# EAGLE design RGB Panel v-1 (EAGLE 6.3)
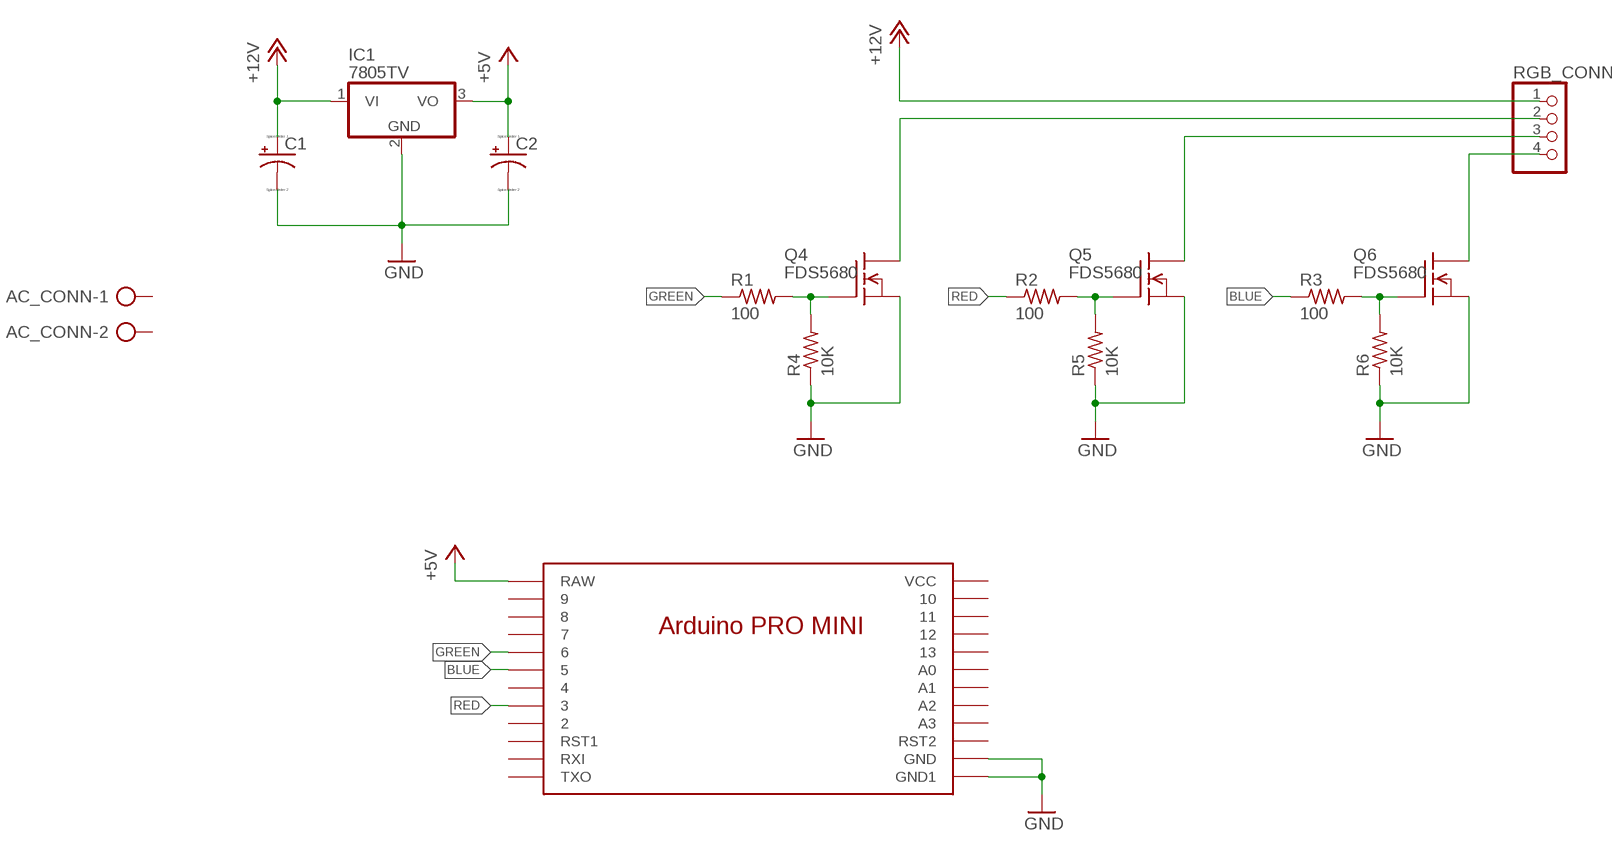
[diagram p0: schematic, sheet 1]

## Parts
AC_CONN  AK300/2  [AK300/2]
C1  CPOL-USE2,5-6E  [E2,5-6E]
C2  CPOL-USE2,5-6E  [E2,5-6E]
IC1  7805TV  [TO220V]
Q4  FDS5680  [SO-8]
Q5  FDS5680  [SO-8]
Q6  FDS5680  [SO-8]
R1  100  R-US_0204/7  [0204/7]
R2  100  R-US_0204/7  [0204/7]
R3  100  R-US_0204/7  [0204/7]
R4  10K  R-US_0204/7  [0204/7]
R5  10K  R-US_0204/7  [0204/7]
R6  10K  R-US_0204/7  [0204/7]
RGB_CONN  PINHD-1X4  [1X04]
U$1  NANO  [NANO]

## Nets
+5V: C2.+ IC1.3(VO) U$1.RAW
+12V: C1.+ IC1.1(VI) RGB_CONN.1
BLUE: R3.1 U$1.5
GND: C1.- C2.- IC1.2(GND) Q4.1(S) Q4.2(S) Q4.3(S) Q5.1(S) Q5.2(S) Q5.3(S) Q6.1(S) Q6.2(S) Q6.3(S) R4.1 R5.1 R6.1 U$1.GND1(GND) U$1.GND2(GND1)
GREEN: R1.1 U$1.6
N$1: Q4.4(G) R1.2 R4.2
N$2: Q5.4(G) R2.2 R5.2
N$3: Q6.4(G) R3.2 R6.2
N$4: Q4.5(D) Q4.6(D) Q4.7(D) Q4.8(D) RGB_CONN.2
N$5: Q5.5(D) Q5.6(D) Q5.7(D) Q5.8(D) RGB_CONN.3
N$6: Q6.5(D) Q6.6(D) Q6.7(D) Q6.8(D) RGB_CONN.4
RED: R2.1 U$1.3
Unconnected: AC_CONN.1 AC_CONN.2 U$1.2 U$1.4 U$1.7 U$1.8 U$1.9 U$1.10 U$1.11 U$1.12 U$1.13 U$1.A0 U$1.A1 U$1.A2 U$1.A3 U$1.RST1 U$1.RST2 U$1.RXI U$1.TXO U$1.VCC

## Library data of the parts
AC_CONN = con-ptr500:AK300/2: CONNECTOR; OC_FARNELL: unknown; OC_NEWARK: unknown
C1 C2 = resistor:CPOL-US: POLARIZED CAPACITOR, American symbol
IC1 = linear:78*: Positive VOLTAGE REGULATOR Source: http://cache.national.com/ds/LM/LM78L05.pdf http://www.fairchildsemi.com/ds/LM/LM7805.pdf
Q4-Q6 = transistor-fet:FDS5680: 60V N-Channel PowerTrench TM MOSFET FAIRCHILD FDS5680.pdf
R1-R6 = resistor:R-US_: RESISTOR, American symbol
RGB_CONN = pinhead:PINHD-1X4: PIN HEADER
U$1 = E-Lab:NANO

## Board
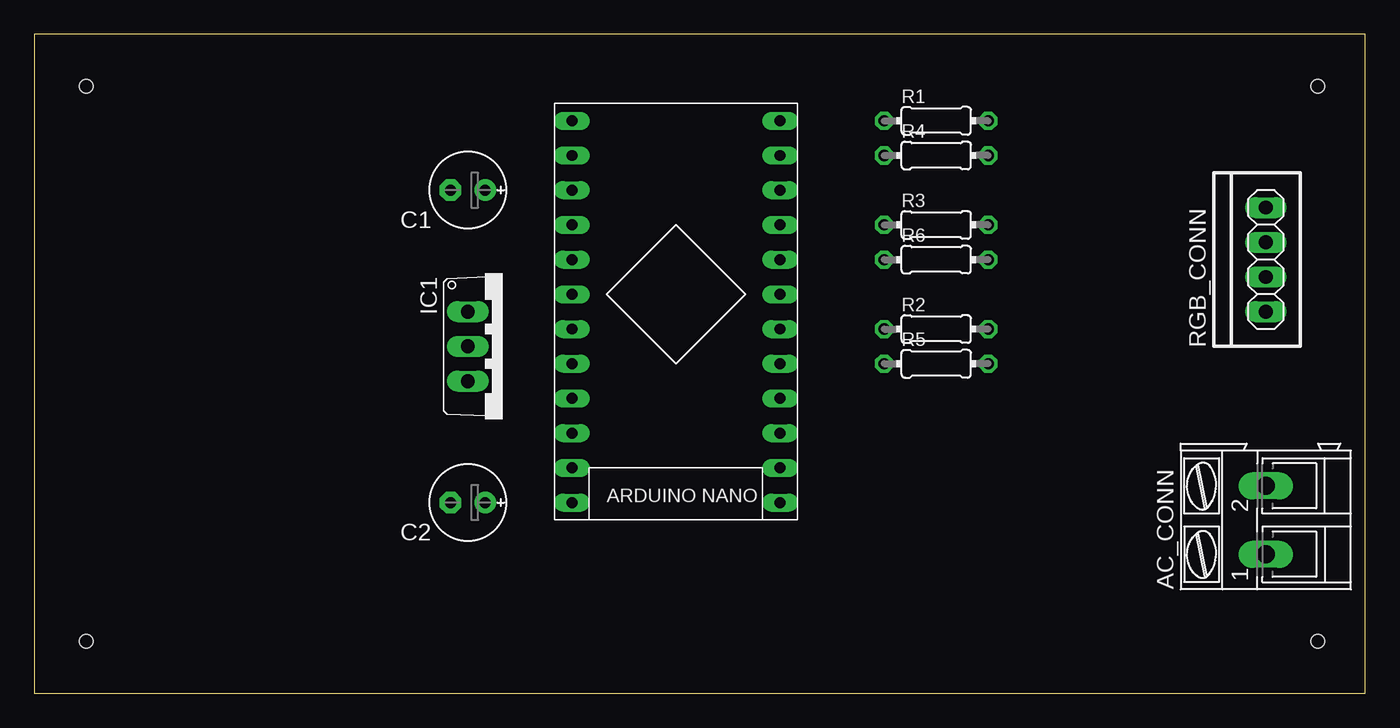
[diagram p1: board, top side]
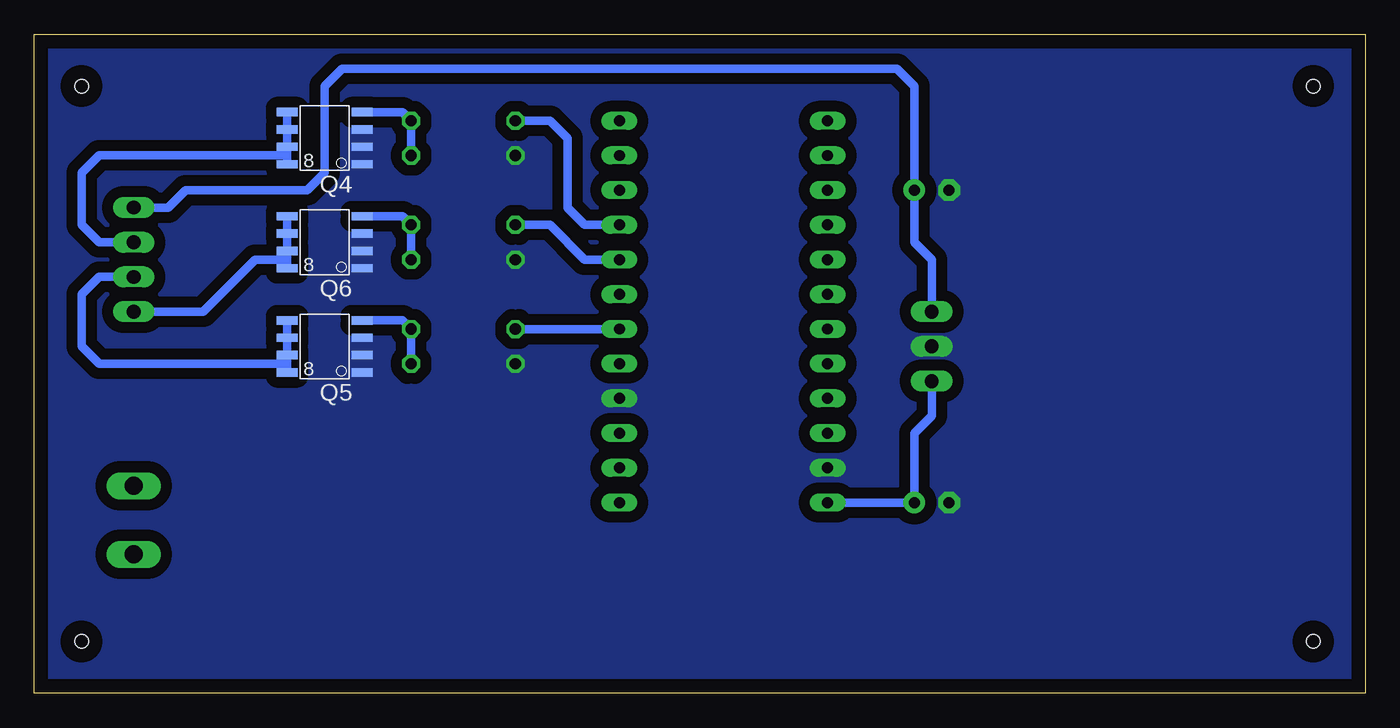
[diagram p2: board, bottom side, seen from below]

Size 97.46 x 48.25 mm. Coordinates in mm from the lower left corner, seen from the top.
Outline: 0,0 97.46,0 97.46,48.25 0,48.25 0,0
Copper layers (1*16): Top 0.035mm / dielectric 1.5mm / Bottom 0.035mm
Design rules "default": minimum track width 10mil, minimum drill 24mil, track to track 8mil, track to pad 8mil, pad to pad 8mil, via to via 8mil, smd to smd 8mil, copper to edge 40mil, drill to drill 8mil, minimum pad ring 10mil, minimum via ring 8mil, stop-mask expansion 4mil, vias tented up to drill 0mil, thermal gap 10mil
Holes 1 mm at 3.81,3.81 3.81,44.45 93.98,44.45 93.98,3.81

### Footprints (pad centres in the part's own frame; a part is rotated, then mirrored left to right if it is on the bottom)
AK300/2 = drill 1.321 long: 1 -2.515,0; 2 2.489,0
E2,5-6E = drill 0.813 pad 1.575: + -1.27,0 | drill 0.813 pad 1.575 octagon: - 1.27,0
TO220V = drill 1.016 long: 1 -2.54,-2.54; 2 0,-2.54; 3 2.54,-2.54
SO-8 = smd 1.524 x 0.61: 1 -2.743,1.905; 2 -2.743,0.635; 3 -2.743,-0.635; 4 -2.743,-1.905; 5 2.743,-1.905; 6 2.743,-0.635; 7 2.743,0.635; 8 2.743,1.905
0204/7 = drill 0.813 octagon: 1 -3.81,0; 2 3.81,0
1X04 = drill 1.016 long: 1 -3.81,0; 2 -1.27,0; 3 1.27,0; 4 3.81,0
NANO = drill 0.8 long: 2 7.62,-5.08; 3 7.62,-2.54; 4 7.62,0; 5 7.62,2.54; 6 7.62,5.08; 7 7.62,7.62; 8 7.62,10.16; 9 7.62,12.7; 10 -7.62,12.7; 11 -7.62,10.16; 12 -7.62,7.62; 13 -7.62,5.08; A0 -7.62,2.54; A1 -7.62,0; A2 -7.62,-2.54; A3 -7.62,-5.08; GND1 -7.62,-12.7; GND2 7.62,-7.62; RAW -7.62,-15.24; RST1 -7.62,-10.16; RST2 7.62,-10.16; RXI 7.62,-12.7; TXO 7.62,-15.24; VCC -7.62,-7.62

### Placement (x,y rotation side)
AC_CONN  90.17,12.7 90 top
C1  31.75,36.83 180 top
C2  31.75,13.97 180 top
IC1  34.29,25.4 270 top
Q4  76.2,40.64 180 bottom
Q5  76.2,25.4 180 bottom
Q6  76.2,33.02 180 bottom
R1  66.04,41.91 0 top
R2  66.04,26.67 0 top
R3  66.04,34.29 0 top
R4  66.04,39.37 0 top
R5  66.04,24.13 0 top
R6  66.04,31.75 0 top
RGB_CONN  90.17,31.75 270 top
U$1  46.99,29.21 0 top

### Tracks (layer width: path | path; a pad name or v marks a point on that pad's centre or on a via)
+5V
  Bottom 0.61: U$1.RAW C2.+ 33.02,19.05 31.75,20.32 IC1.3
+12V
  Bottom 0.61: IC1.1 31.75,31.75 33.02,33.02 C1.+ 33.02,44.45 34.29,45.72 74.93,45.72 76.2,44.45 76.2,38.1 77.47,36.83 86.36,36.83 87.63,35.56 RGB_CONN.1
BLUE
  Bottom 0.61: U$1.5 57.15,31.75 59.69,34.29 R3.1
GND
  pour Bottom (isolate 0.813, no thermals): 0,0 0,48.26 97.79,48.26 97.79,0
GREEN
  Bottom 0.61: U$1.6 57.15,34.29 58.42,35.56 58.42,40.64 59.69,41.91 R1.1
N$1
  Bottom 0.61: R4.2 R1.2 70.48,42.55 Q4.4
N$2
  Bottom 0.61: R5.2 R2.2 70.48,27.3 Q5.4
N$3
  Bottom 0.61: R6.2 R3.2 70.48,34.92 Q6.4
N$4
  Bottom 0.61: Q4.5 Q4.6 Q4.7 78.94,39.37 | 78.94,39.37 Q4.8 | RGB_CONN.2 92.71,33.02 93.98,34.29 93.98,38.1 92.71,39.37 78.94,39.37
N$5
  Bottom 0.61: Q5.5 Q5.6 Q5.7 78.94,24.13 | Q5.8 78.94,24.13 | RGB_CONN.3 92.71,30.48 93.98,29.21 93.98,25.4 92.71,24.13 78.94,24.13
N$6
  Bottom 0.61: Q6.5 Q6.6 Q6.7 78.94,31.75 | 78.94,31.75 Q6.8 | 78.94,31.75 81.28,31.75 85.09,27.94 RGB_CONN.4
RED
  Bottom 0.61: U$1.3 R2.1